# EAGLE schematic MCP73213 (EAGLE 6.4)
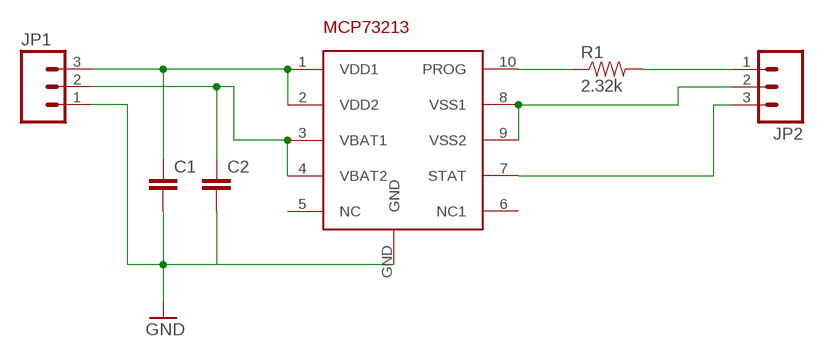
[diagram p0: schematic, sheet 1]

## Parts
C1  CAP0805  [0805]
C2  CAP0805  [0805]
JP1  M03LOCK  [1X03_LOCK]
JP2  M03LOCK  [1X03_LOCK]
R1  2.32k  RESISTOR0805-RES  [0805]
U$1  MCP73213  [DFN10_3X3MM]

## Nets
GND: C1.2 C2.2 JP1.1 U$1.GND
N$1: C1.1 JP1.3 U$1.1(VDD1) U$1.2(VDD2)
N$2: C2.1 JP1.2 U$1.3(VBAT1) U$1.4(VBAT2)
N$3: R1.1 U$1.10(PROG)
N$4: JP2.1 R1.2
N$5: JP2.2 U$1.8(VSS1) U$1.9(VSS2)
N$6: JP2.3 U$1.7(STAT)
Unconnected: U$1.5(NC) U$1.6(NC1)

## Library data of the parts
C1 C2 = SparkFun:CAP: Capacitor Standard 0603 ceramic capacitor, and 0.1" leaded capacitor.
JP1 JP2 = SparkFun:M03: Header 3 Standard 3-pin 0.1" header. Use with straight break away headers (SKU : PRT-00116), right angle break away headers (PRT-00553), swiss pins (PRT-00743), machine pins (PRT-00117), and female headers (PRT-00115). Molex polarized connector foot print use with SKU : PRT-08232 with associated crimp pins and housings.
R1 = SparkFun:RESISTOR: Resistor Basic schematic elements and footprints for 0603, 1206, and PTH resistors.
U$1 = microbuilder:MCP73213